# EasyEDA schematic Smart Home Teleinfo.json
TITLE: Sheet_1; REV: 1.0; Date: 2019-08-25; Sheet: 1/1; Drawn By: Cognitician; Company: TOCHE Corp
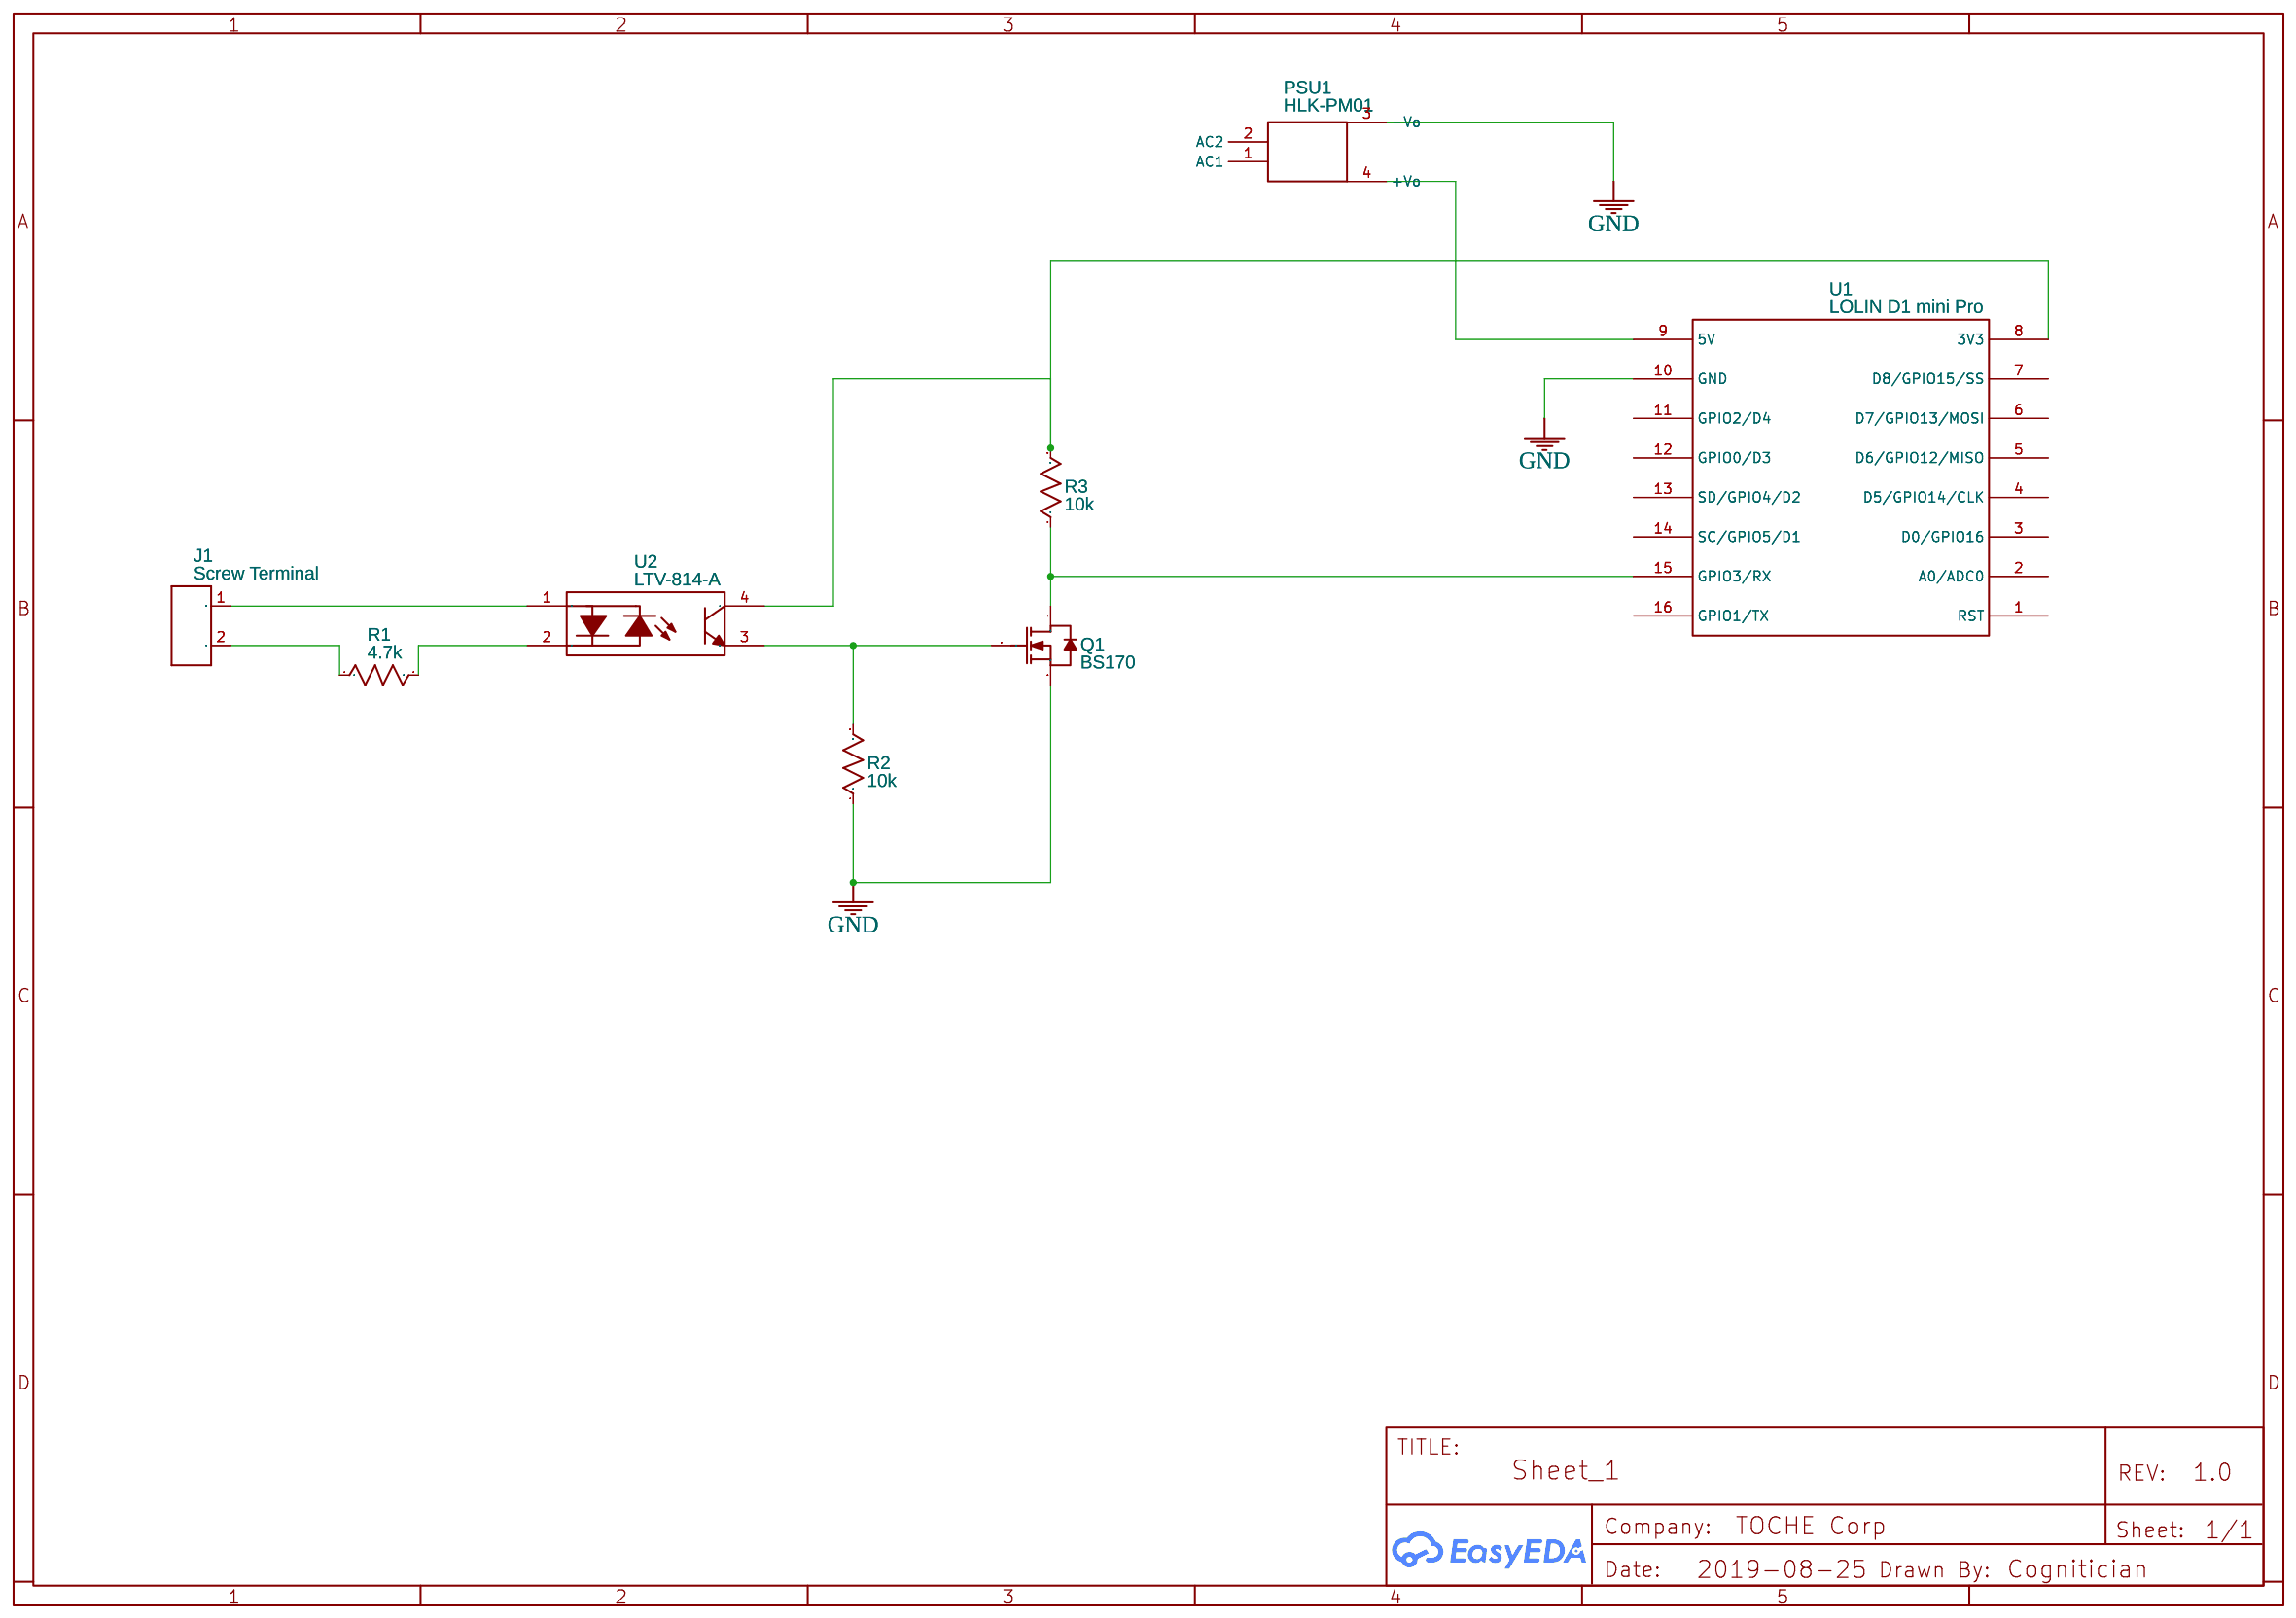
[diagram p0: schematic sheet]

## Parts
J1  Screw Terminal  [H2-3.5-7.0X7.0MM]
PSU1  HLK-PM01  [HLK-PM01]
Q1  BS170  [TO-92]
R1  4.7k  [AXIAL-0.3]
R2  10k  [AXIAL-0.3]
R3  10k  [AXIAL-0.3]
U1  LOLIN D1 mini Pro  [LOLIN D1 MINI PRO]
U2  LTV-814-A  [DIP-4]

## Library data of the parts
J1 = -: Manufacturer Part: ?
PSU1 = -: Manufacturer Part: ?; Supplier: Self; Contributor: rafaeltrin
Q1 = -: Supplier: LCSC; Manufacturer: FAIRCHILD; Supplier Part: C111691
R1-R3 = Res_AXIAL-0.3(1/8W)_US: Manufacturer Part: ?
U1 = -: Manufacturer: LOLIN; Manufacturer Part: ?; Contributor: Robert Błaszczak
U2 = -: Supplier: LCSC; Manufacturer: LITEON; Contributor: LCSC; Supplier Part: C115454

## Nets
GND: PSU1.3(-Vo) Q1.3(S) R2.1 U1.10(GND)
Net-(J1-1): J1.1(2) U2.1
Net-(J1-2): J1.2(1) R1.1
Net-(PSU1-4): PSU1.4(+Vo) U1.9(5V)
Net-(Q1-1): Q1.1(D) R3.1 U1.15(GPIO3/RX)
Net-(Q1-2): Q1.2(G) R2.2 U2.3
Net-(R1-2): R1.2 U2.2
Net-(R3-2): R3.2 U1.8(3V3) U2.4

Not connected (* = marked no-connect by the designer): PSU1 1(AC1) 2(AC2); U1 1(RST) 2(A0/ADC0) 3(D0/GPIO16) 4(D5/GPIO14/CLK) 5(D6/GPIO12/MISO) 6(D7/GPIO13/MOSI) 7(D8/GPIO15/SS) 11(GPIO2/D4) 12(GPIO0/D3) 13(SD/GPIO4/D2) 14(SC/GPIO5/D1) 16(GPIO1/TX)
